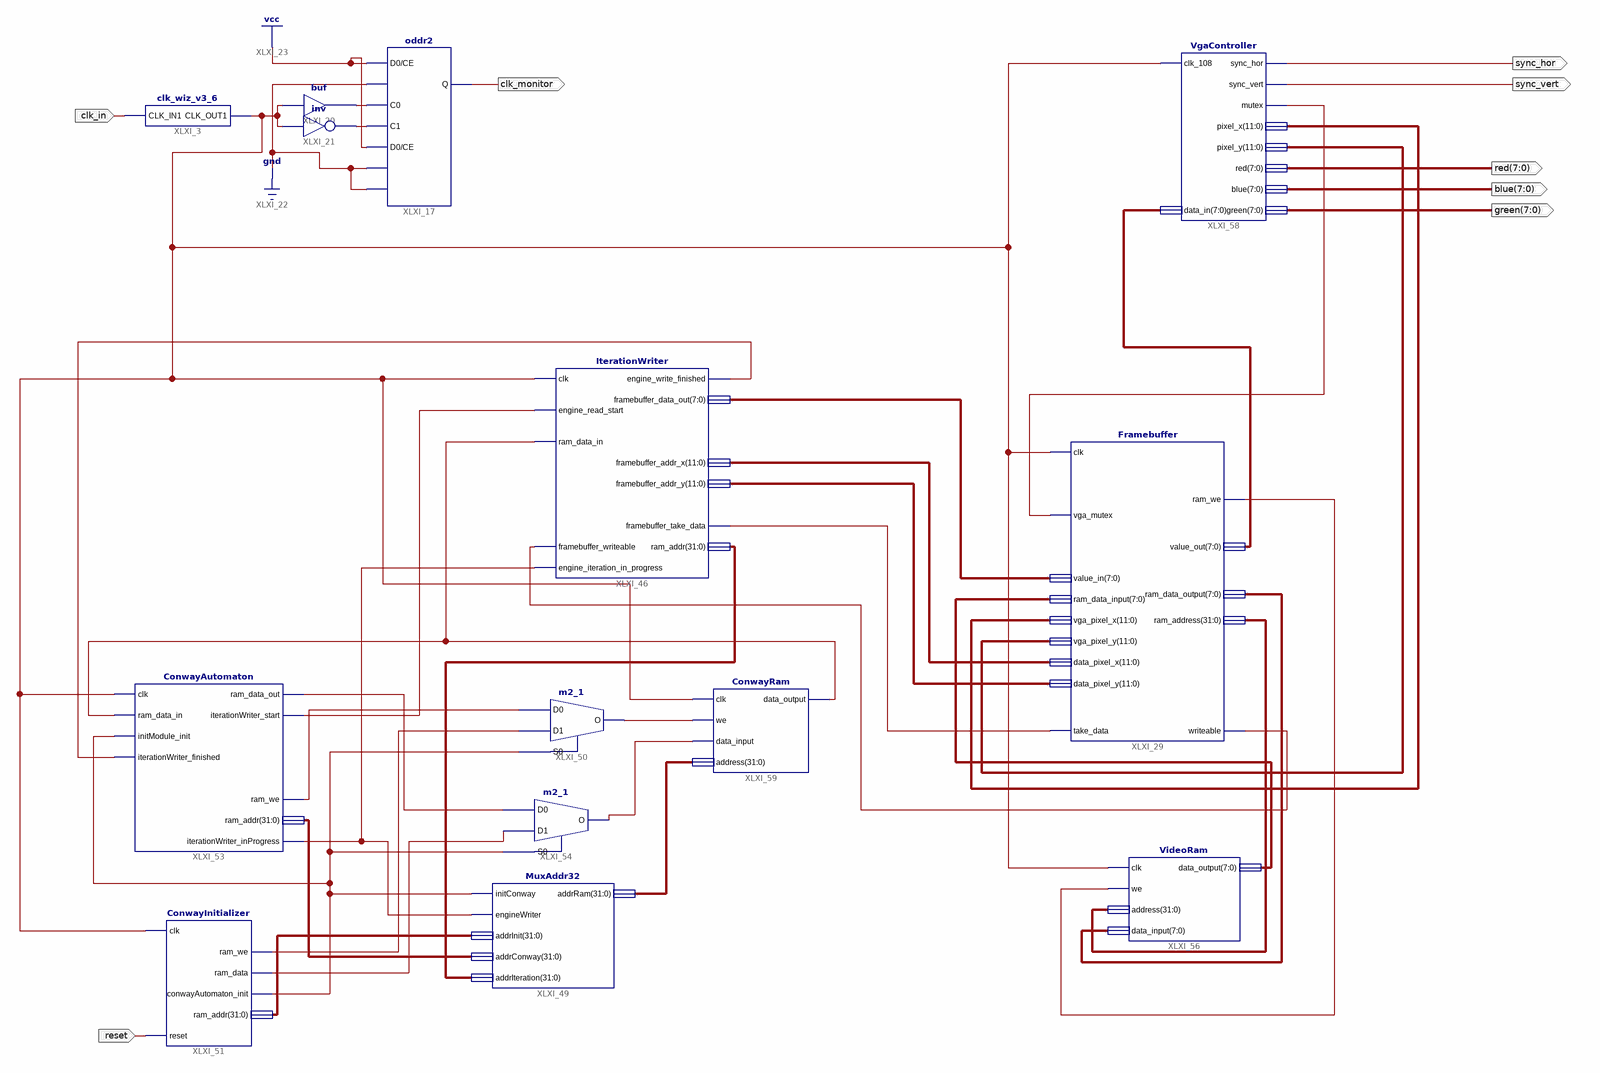
[diagram p0: schematic sheet 1]
// Xilinx ISE schematic gesamt.sch (spartan6) as structural Verilog: 14 symbols, 8 ports
module gesamt (
  input  clk_in,
  input  reset,
  output clk_monitor,
  output sync_hor,
  output sync_vert,
  output [7:0] red,
  output [7:0] blue,
  output [7:0] green
);

  wire XLXN_42, XLXN_43, XLXN_63, XLXN_85, XLXN_192, XLXN_195, XLXN_196, XLXN_200, XLXN_209, XLXN_215,
       XLXN_217, XLXN_223, XLXN_234, XLXN_235, XLXN_236, XLXN_238, XLXN_241, XLXN_243;
  wire [7:0] XLXN_95, XLXN_96, XLXN_199, XLXN_255;
  wire [11:0] XLXN_68, XLXN_69, XLXN_197, XLXN_198;
  wire [31:0] XLXN_213, XLXN_214, XLXN_220, XLXN_222, XLXN_256;

  oddr2 XLXI_17 (.D0(1'b1), .D1(1'b0), .C0(XLXN_42), .C1(XLXN_43), .CE(1'b1), .R(1'b0), .Q(clk_monitor), .S(1'b0));
  clk_wiz_v3_6 XLXI_3 (.CLK_IN1(clk_in), .CLK_OUT1(XLXN_209));
  buf XLXI_20 (XLXN_42, XLXN_209);
  not XLXI_21 (XLXN_43, XLXN_209);
  Framebuffer XLXI_29 (
    .clk(XLXN_209), .vga_mutex(XLXN_85), .take_data(XLXN_196), .vga_pixel_x(XLXN_69), .vga_pixel_y(XLXN_68),
    .value_in(XLXN_199), .data_pixel_x(XLXN_198), .data_pixel_y(XLXN_197), .ram_data_input(XLXN_96),
    .writeable(XLXN_195), .ram_we(XLXN_63), .value_out(XLXN_95), .ram_address(XLXN_256),
    .ram_data_output(XLXN_255));
  IterationWriter XLXI_46 (
    .clk(XLXN_209), .engine_read_start(XLXN_238), .ram_data_in(XLXN_192), .framebuffer_writeable(XLXN_195),
    .engine_write_finished(XLXN_200), .framebuffer_take_data(XLXN_196), .framebuffer_data_out(XLXN_199),
    .ram_addr(XLXN_214), .framebuffer_addr_x(XLXN_198), .framebuffer_addr_y(XLXN_197),
    .engine_iteration_in_progress(XLXN_243));
  MuxAddr32 XLXI_49 (
    .initConway(XLXN_241), .engineWriter(XLXN_243), .addrInit(XLXN_220), .addrConway(XLXN_222),
    .addrIteration(XLXN_214), .addrRam(XLXN_213));
  m2_1 XLXI_50 (.D0(XLXN_223), .D1(XLXN_217), .S0(XLXN_241), .O(XLXN_215));
  ConwayInitializer XLXI_51 (
    .clk(XLXN_209), .ram_we(XLXN_217), .ram_data(XLXN_236), .conwayAutomaton_init(XLXN_241),
    .ram_addr(XLXN_220), .reset(reset));
  m2_1 XLXI_54 (.D0(XLXN_235), .D1(XLXN_236), .S0(XLXN_241), .O(XLXN_234));
  ConwayAutomaton XLXI_53 (
    .clk(XLXN_209), .ram_data_in(XLXN_192), .initModule_init(XLXN_241), .iterationWriter_finished(XLXN_200),
    .ram_data_out(XLXN_235), .ram_we(XLXN_223), .iterationWriter_start(XLXN_238), .ram_addr(XLXN_222),
    .iterationWriter_inProgress(XLXN_243));
  VideoRam XLXI_56 (.clk(XLXN_209), .we(XLXN_63), .address(XLXN_256), .data_input(XLXN_255), .data_output(XLXN_96));
  VgaController XLXI_58 (
    .clk_108(XLXN_209), .data_in(XLXN_95), .sync_hor(sync_hor), .sync_vert(sync_vert), .mutex(XLXN_85),
    .pixel_x(XLXN_69), .pixel_y(XLXN_68), .red(red), .blue(blue), .green(green));
  ConwayRam XLXI_59 (.clk(XLXN_209), .we(XLXN_215), .data_input(XLXN_234), .address(XLXN_213), .data_output(XLXN_192));
endmodule
